# EasyEDA Pro project ProPrj_Practice 4 layer_2025-09-09.epro, schematic Current Output
Board Name: Current Output; Create Date: 2025-08-13; Page Name: P1; Project Name: Practice 4 layer; Schematic Name: Schematic4; Update Date: 2025-08-13; Company: EasyEDA.com; Page Size: A4; Version: V1.0
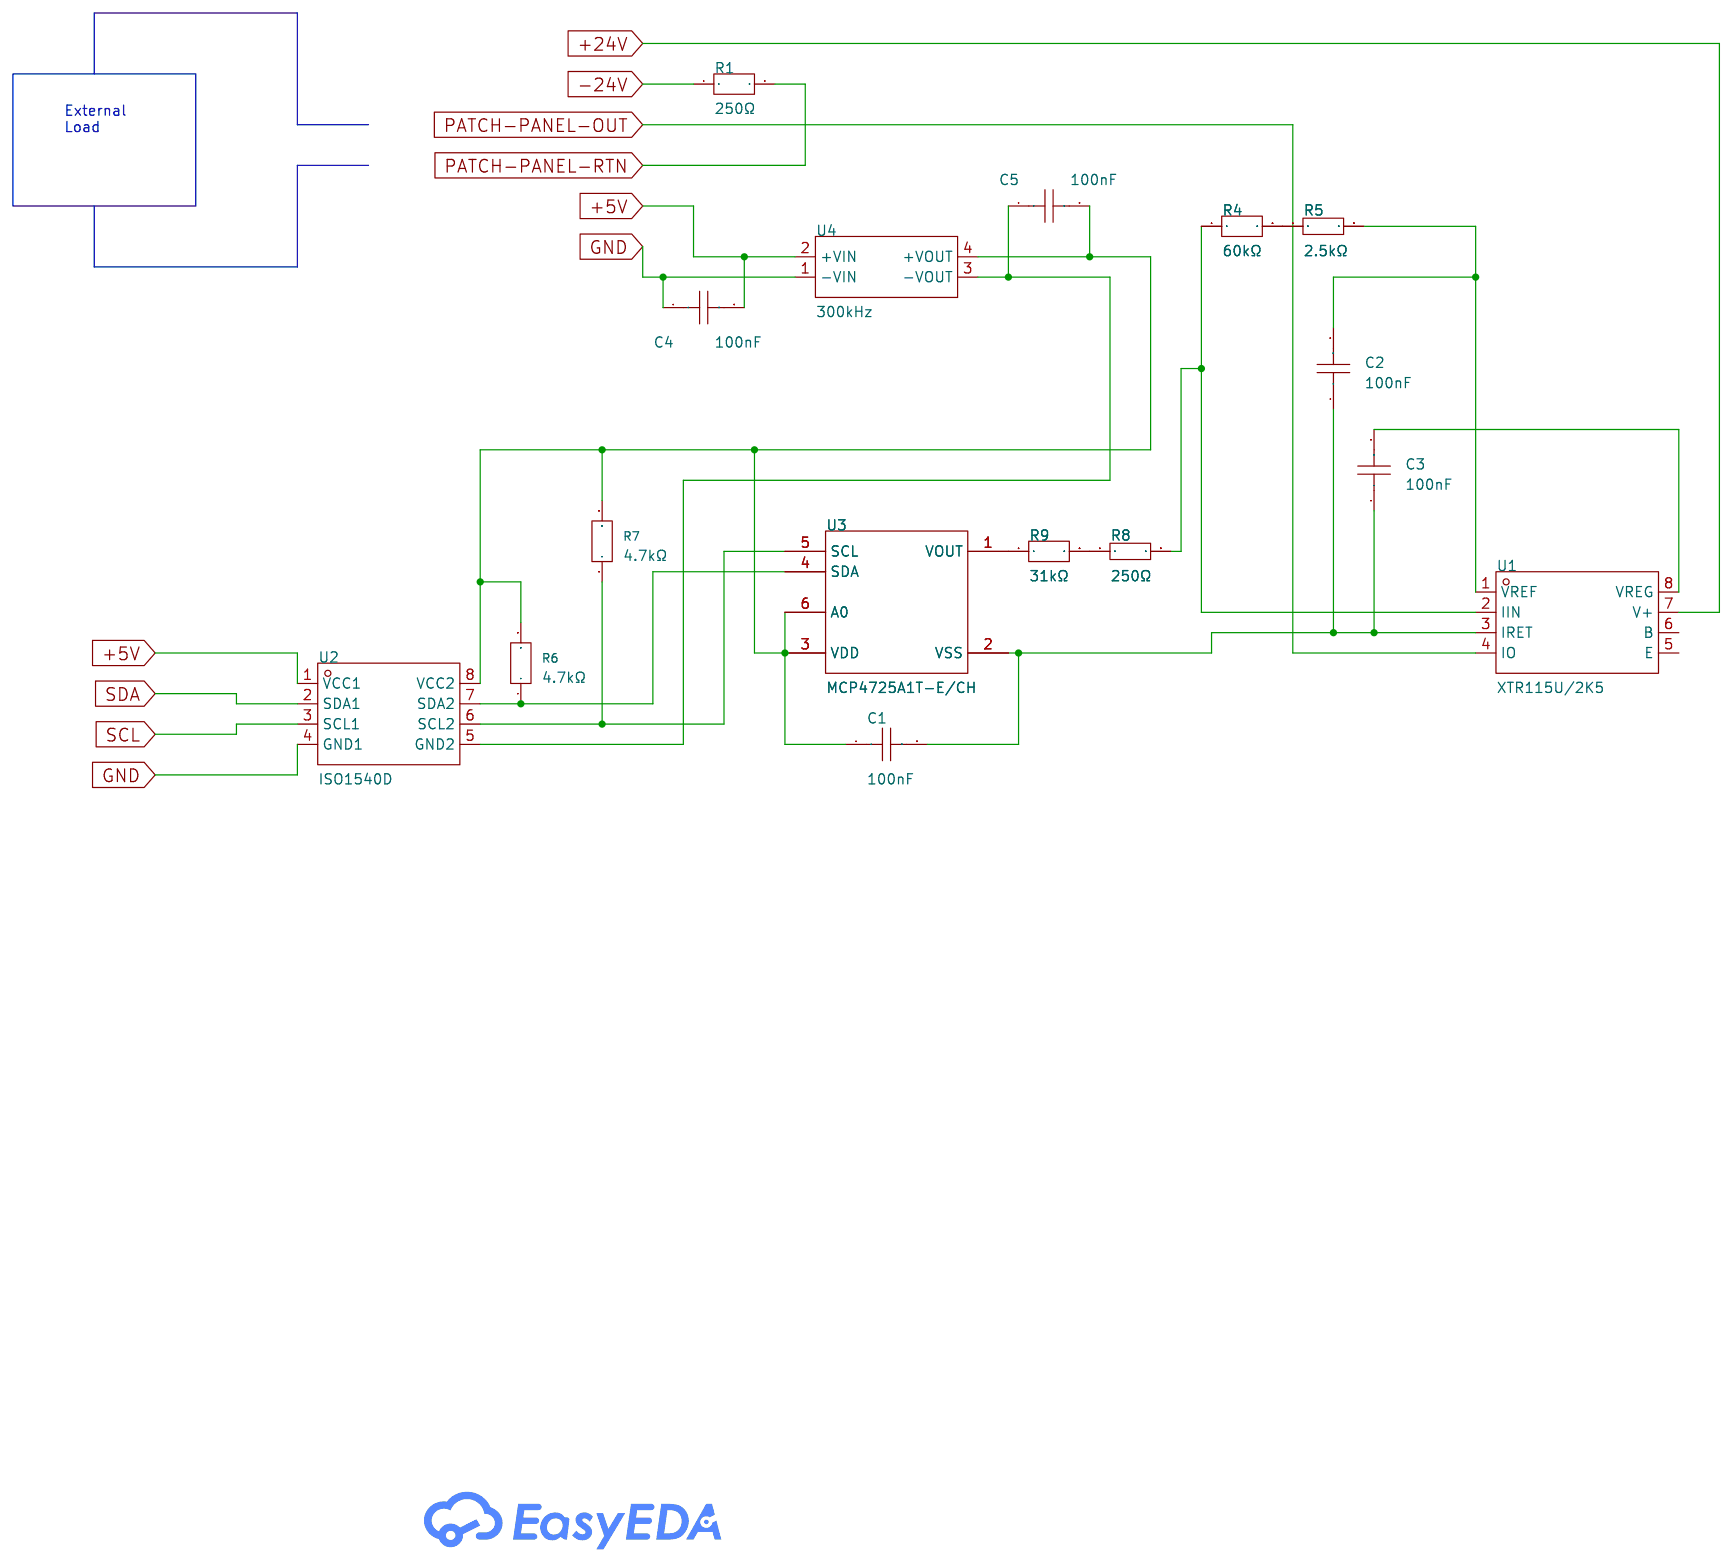
[diagram p0: schematic sheet]

## Parts
C1  100nF  [C0603]
C2  100nF  [C0603]
C3  100nF  [C0603]
C4  100nF  [C0603]
C5  100nF  [C0603]
R1  250Ω  [R0603]
R4  60kΩ  [RES-SMD_L1.55-W0.85]
R5  2.5kΩ  [R0603]
R6  4.7kΩ  [R0603]
R7  4.7kΩ  [R0603]
R8  250Ω  [R0603]
R9  31kΩ  [R0603]
U1  XTR115U/2K5  [SOIC-8_L5.0-W4.0-P1.27-LS6.0-BL]
U2  ISO1540D  [SOIC-8_L5.0-W4.0-P1.27-LS6.0-BL]
U3  MCP4725A1T-E/CH  [SOT-23-6_L2.9-W1.6-P0.95-LS2.8-BR]
U4  300kHz  [PWRM-TH_NME0505SC]

## Library data of the parts
C1-C5 = CC0603KRX7R9BB104: Capacitance:100nF Tolerance:±10% Tolerance:±10% Voltage Rating:50V Temperature Coefficient:X7R; LCSC Part Name: 100nF ±10% 50V; Supplier Part: C14663; Manufacturer: YAGEO(国巨); Supplier Footprint: 0603; JLCPCB Part Class: Basic Part; Datasheet: https://atta.szlcsc.com/upload/public/pdf/source/20250214/096C4C206003071F5D32E5F0D8E7F8DF.pdf; Supplier: LCSC; Tolerance: ±10%; Voltage Rating: 50V; Temperature Coefficient: X7R
R1 = ARG03DTC2500: Type:Thin Film Resistor Resistance:250Ω Tolerance:±0.5% Tolerance:±0.5% Power(Watts):100mW Voltage-Supply(Max):75V Temperature Coefficient:±25ppm/℃ Temperature Coefficient:±25ppm/℃ Operating Temperature:-55℃~+155℃ Operating Temperature:-55℃~+155℃; LCSC Part Name: 薄膜电阻 250Ω ±0.5% 100mW; Supplier Part: C2828652; Manufacturer: Viking(光颉); Supplier Footprint: 0603; JLCPCB Part Class: Extended Part; Datasheet: https://atta.szlcsc.com/upload/public/pdf/source/20211009/C2828883_CAE7D170B8B230FC4A048BDC7B3A81FC.pdf; Supplier: LCSC; Type: Thin Film Resistor; Tolerance: ±0.5%; Power(Watts): 100mW; Voltage-Supply(Max): 75V; Temperature Coefficient: ±25ppm/℃; Operating Temperature: -55℃~+155℃
R4 = RT0603BRD0760KL: Type:Thin Film Resistor Resistance:60kΩ Tolerance:±0.1% Tolerance:±0.1% Power(Watts):100mW Temperature Coefficient:±25ppm/℃ Temperature Coefficient:±25ppm/℃ Operating Temperature:-55℃~+155℃ Operating Temperature:-55℃~+155℃; LCSC Part Name: 薄膜电阻 60kΩ ±0.1% 100mW; Supplier Part: C6460576; Manufacturer: YAGEO(国巨); Supplier Footprint: 0603; JLCPCB Part Class: Extended Part; Datasheet: https://atta.szlcsc.com/upload/public/pdf/source/20250609/0E6D5617EADA80FA3B707391883DF2D5.pdf; Supplier: LCSC; Type: Thin Film Resistor; Tolerance: ±0.1%; Power(Watts): 100mW; Temperature Coefficient: ±25ppm/℃; Operating Temperature: -55℃~+155℃
R5 = AR03BTC2501: Resistance:2.5kΩ Tolerance:±0.1% Tolerance:±0.1% Power(Watts):62.5mW Temperature Coefficient:±25ppm/℃ Temperature Coefficient:±25ppm/℃; LCSC Part Name: 2.5kΩ ±0.1% 62.5mW; Supplier Part: C304065; Manufacturer: Viking(光颉); Supplier Footprint: 0603; JLCPCB Part Class: Extended Part; Datasheet: https://item.szlcsc.com/datasheet/AR03BTC2501/288132.html; Supplier: LCSC; Tolerance: ±0.1%; Power(Watts): 62.5mW; Temperature Coefficient: ±25ppm/℃
R6 R7 = FRC0603J472 TS: Type:Thick Film Resistors Resistance:4.7kΩ Tolerance:±5% Tolerance:±5% Power(Watts): Overload Voltage (Max): Temperature Coefficient:±100ppm/℃ Temperature Coefficient:±100ppm/℃ Operating Temperature Range:-55℃~+155℃ Operating Temperature Range:-55℃~+155℃; LCSC Part Name: 4.7kΩ ±5% 100mW 厚膜电阻; Supplier Part: C2907166; Manufacturer: FOJAN(富捷); Supplier Footprint: 0603; JLCPCB Part Class: Extended Part; Datasheet: https://atta.szlcsc.com/upload/public/pdf/source/20211221/925EC7D7225764EE0046F22065062C87.pdf; Supplier: LCSC; Type: Thick Film Resistors; Tolerance: ±5%; Temperature Coefficient: ±100ppm/℃; Operating Temperature Range: -55℃~+155℃
R8 = RT0603BRE07250RL: Type:Thin Film Resistor Resistance:250Ω Tolerance:±0.1% Tolerance:±0.1% Power(Watts):100mW Temperature Coefficient:±50ppm/℃ Temperature Coefficient:±50ppm/℃ Operating Temperature:-55℃~+155℃ Operating Temperature:-55℃~+155℃; LCSC Part Name: 薄膜电阻 250Ω ±0.1% 100mW; Supplier Part: C861779; Manufacturer: YAGEO(国巨); Supplier Footprint: 0603; JLCPCB Part Class: Extended Part; Datasheet: https://atta.szlcsc.com/upload/public/pdf/source/20250609/0E6D5617EADA80FA3B707391883DF2D5.pdf; Supplier: LCSC; Type: Thin Film Resistor; Tolerance: ±0.1%; Power(Watts): 100mW; Temperature Coefficient: ±50ppm/℃; Operating Temperature: -55℃~+155℃
R9 = 0603WAF3102T5E: Type:Thick Film Resistors Resistance:31kΩ Tolerance:±1% Tolerance:±1% Power(Watts):0.1W Voltage-Supply(Max):75V Temperature Coefficient:±100ppm/℃ Temperature Coefficient:±100ppm/℃ Operating Temperature:-55℃~+155℃ Operating Temperature:-55℃~+155℃; LCSC Part Name: 31kΩ ±1% 100mW 厚膜电阻; Supplier Part: C2767175; Manufacturer: UNI-ROYAL(厚声); Supplier Footprint: 0603; JLCPCB Part Class: Extended Part; Datasheet: https://atta.szlcsc.com/upload/public/pdf/source/20200306/C422600_1E6D84923E4A46A82E41ADD87F860B5C.pdf; Supplier: LCSC; Type: Thick Film Resistors; Tolerance: ±1%; Power(Watts): 0.1W; Voltage-Supply(Max): 75V; Temperature Coefficient: ±100ppm/℃; Operating Temperature: -55℃~+155℃
U1 = XTR115U/2K5: Voltage - Supply:7.5V~36V Voltage - Supply:7.5V~36V Operating Temperature:-40℃~+85℃ Operating Temperature:-40℃~+85℃; Supplier Part: C99444; Manufacturer: TI(德州仪器); Supplier Footprint: SOIC-8; JLCPCB Part Class: Extended Part; Datasheet: https://www.ti.com/cn/lit/gpn/xtr115; Supplier: LCSC; Voltage - Supply: 7.5V~36V; Operating Temperature: -40℃~+85℃
U2 = ISO1540D: Number of Forward Channels:2 Number of Reverse Channels:2 Data Rate(Max):1Mbps Isolation Voltage(Vrms):2500 Operating Temperature:-40℃~+125℃ Operating Temperature:-40℃~+125℃; Supplier Part: C2878172; Manufacturer: TI(德州仪器); Supplier Footprint: SOIC-8; JLCPCB Part Class: Extended Part; Datasheet: https://www.ti.com/cn/lit/gpn/iso1540; Supplier: LCSC; Number of Forward Channels: 2; Number of Reverse Channels: 2; Data Rate(Max): 1Mbps; Isolation Voltage(Vrms): 2500; Operating Temperature: -40℃~+125℃
U3 = MCP4725A1T-E/CH: Resolution(Bits):12 Number of Channels:1 Interface:I2C Voltage - Supply:2.7V~5.5V Voltage - Supply:2.7V~5.5V Settling Time:6us Output Type:- Integral non - linearity:2LSB Integral non - linearity:2LSB Operating Temperature:-40℃~+125℃ Operating Temperature; LCSC Part Name: 12-位数字到模拟转换器带EEPROM内存，采用SOT-23-6封装; Supplier Part: C61423; Manufacturer: MICROCHIP(美国微芯); Supplier Footprint: SOT-23-6; JLCPCB Part Class: Extended Part; Datasheet: https://atta.szlcsc.com/upload/public/pdf/source/20151029/1457707542566.pdf; Supplier: LCSC; Resolution(Bits): 12; Number of Channels: 1; Interface: I2C; Voltage - Supply: 2.7V~5.5V; Settling Time: 6us; Integral non - linearity: 2LSB; Operating Temperature: -40℃~+125℃
U4 = NME0505SC: Number of Channels:1 Output Power:1W Voltage - Supply:4.5V~5.5V Voltage - Supply:4.5V~5.5V Conversion Efficiency:80% Conversion Efficiency:80% Output Voltage:5V Output Voltage:5V Output Current(Max):200mA Output Current(Max):200mA Capacitive Load(Max):200; LCSC Part Name: DC/DC电源模块，定电压输入，隔离非稳压单路输出; Supplier Part: C22371841; Manufacturer: YLPTEC(易川); Supplier Footprint: SIP,11.7x6mm; JLCPCB Part Class: Extended Part; Datasheet: https://item.szlcsc.com/datasheet/NME0505SC/23862503.html; Supplier: LCSC; Number of Channels: 1; Output Power: 1W; Voltage - Supply: 4.5V~5.5V; Conversion Efficiency: 80%; Output Voltage: 5V; Output Current(Max): 200mA; Capacitive Load(Max): 200uF; Isolation Voltage(Vrms): 1.5kV; Features: Short Circuit Protection; Operating Temperature: -40℃~+85℃

## Nets
+5V: C4.2 U2.1(VCC1) U4.2(+VIN)
+24V: U1.7(V+)
-24V: R1.1
GND: C4.1 U2.4(GND1) U4.1(-VIN)
PATCH-PANEL-OUT: U1.4(IO)
PATCH-PANEL-RTN: R1.2
SCL: U2.3(SCL1)
SDA: U2.2(SDA1)
Net-(C1-1): C1.1 C5.2 R6.2 R7.2 U2.8(VCC2) U3.3(VDD) U3.6(A0) U4.4(+VOUT)
Net-(C1-2): C1.2 C2.1 C3.1 U1.3(IRET) U3.2(VSS)
Net-(C2-2): C2.2 R5.2 U1.1(VREF)
Net-(C3-2): C3.2 U1.8(VREG)
Net-(C5-1): C5.1 U2.5(GND2) U4.3(-VOUT)
Net-(R4-1): R4.1 R8.2 U1.2(IIN)
Net-(R4-2): R4.2 R5.1
Net-(R6-1): R6.1 U2.7(SDA2) U3.4(SDA)
Net-(R7-1): R7.1 U2.6(SCL2) U3.5(SCL)
Net-(R8-1): R8.1 R9.2
Net-(R9-1): R9.1 U3.1(VOUT)

Not connected (* = marked no-connect by the designer): U1 5(E) 6(B)

## Notes on the sheet
- External
  Load
